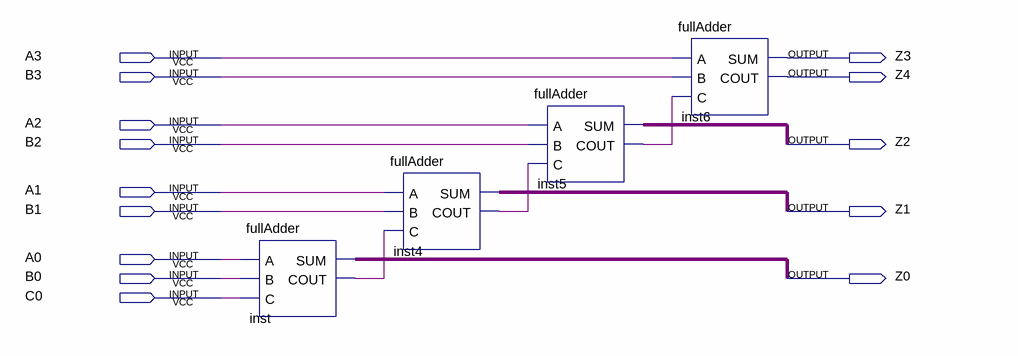
[diagram p0: schematic sheet]
// Quartus schematic Lab_2.bdf as structural Verilog: 4 symbols, 14 pins
module Lab_2 (
  input  A3,
  input  B3,
  input  A2,
  input  B2,
  input  A1,
  input  B1,
  input  A0,
  input  B0,
  input  C0,
  output Z3,
  output Z4,
  output Z2,
  output Z1,
  output Z0
);

  wire inst4_cout, inst5_cout, inst_cout;

  fullAdder inst (.A(A0), .B(B0), .C(C0), .SUM(Z0), .COUT(inst_cout));
  fullAdder inst4 (.A(A1), .B(B1), .C(inst_cout), .SUM(Z1), .COUT(inst4_cout));
  fullAdder inst5 (.A(A2), .B(B2), .C(inst4_cout), .SUM(Z2), .COUT(inst5_cout));
  fullAdder inst6 (.A(A3), .B(B3), .C(inst5_cout), .SUM(Z3), .COUT(Z4));
endmodule
